# EAGLE board darwin-weather-module (EAGLE 9.6.1), part 1 of 2
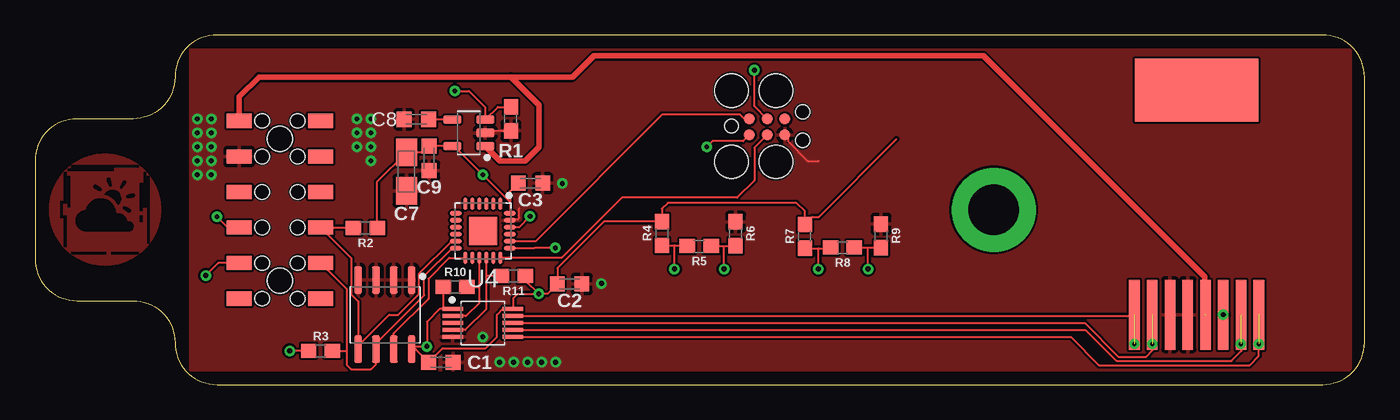
[diagram p1: board, top side]
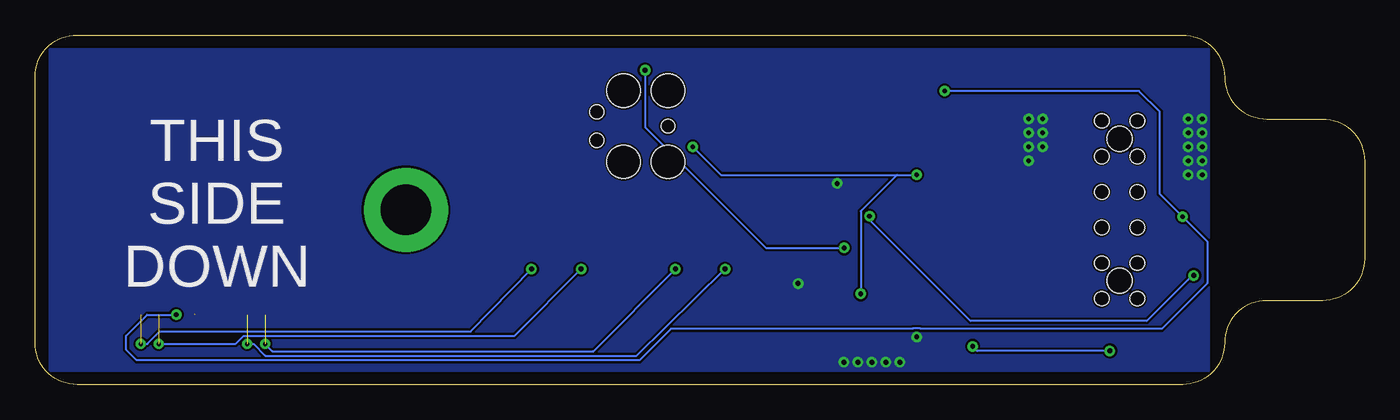
[diagram p2: board, bottom side, seen from below]

Size 95 x 25 mm. Coordinates in mm from the lower left corner, seen from the top.
Outline: 92,0 arc90 95,3 95,22 arc90 92,25 13,25 arc90 10,22 arc-90 7,19 3,19 arc90 0,16 0,9 arc90 3,6 7,6 arc-90 10,3 arc90 13,0 92,0
Copper layers (1*16): Top 0.035mm / dielectric 1.5mm / Bottom 0.035mm
Design rules "default *": minimum track width 6mil, minimum drill 0.35mm, track to track 6mil, track to pad 6mil, pad to pad 6mil, via to via 6mil, smd to smd 6mil, copper to edge 6mil, drill to drill 6mil, minimum pad ring 10mil, minimum via ring 8mil, stop-mask expansion 4mil, vias tented up to drill 40mil, thermal gap 10mil

## Footprints (pad centres in the part's own frame; a part is rotated, then mirrored left to right if it is on the bottom)
C0603K = smd 1.05 x 1.08: 1 -0.875,0; 2 0.875,0
A/3216-18R = smd 1.95 x 1.5: + 1.375,0; - -1.375,0
M20-7810645 = smd 1.02 x 1.78: P$1 -6.35,-2.91; P$2 -3.81,-2.91; P$3 -1.27,-2.91; P$4 1.27,-2.91; P$5 3.81,-2.91; P$6 6.35,-2.91; P$7 6.35,2.91; P$8 3.81,2.91; P$9 1.27,2.91; P$10 -1.27,2.91; P$11 -3.81,2.91; P$12 -6.35,2.91 | hole 1.02: -6.35,1.27; -3.81,1.27; -1.27,1.27; 1.27,1.27; 3.81,1.27; 6.35,1.27; 6.35,-1.27; 3.81,-1.27; 1.27,-1.27; -1.27,-1.27; -3.81,-1.27; -6.35,-1.27 | hole 1.8: -5.08,0; 5.08,0
85513-5009 = smd 0.76 x 5: 1 4.445,0; 2 3.175,0; 3 1.905,0; 4 0.635,0; 5 -0.635,0; 6 -1.905,0; 7 -3.175,0; 8 -4.445,0 | smd 8.8 x 4.5: P$1 0,16.05
TC2030-IDC = smd 0.787 x 0.787: GND 3.81,-0.635; NRESET 2.54,-0.635; SWCLK/TCK 2.54,0.508; SWDIO/TMS 1.27,0.508; SWO/TDO 3.81,0.508; VCC 1.27,-0.635 | hole 0.991: 0,0; 5.08,1.016; 5.08,-1.016 | hole 2.375: 0,2.54; 0,-2.54; 3.175,2.54; 3.175,-2.54
0603 = smd 1.1 x 1: 1 -0.85,0; 2 0.85,0
QFN50P400X400X100-25T200 = smd 0.837 x 0.27: 1 -1.937,1.25; 2 -1.937,0.75; 3 -1.937,0.25; 4 -1.937,-0.25; 5 -1.937,-0.75; 6 -1.937,-1.25; 13 1.937,-1.25; 14 1.937,-0.75; 15 1.937,-0.25; 16 1.937,0.25; 17 1.937,0.75; 18 1.937,1.25 | smd 0.27 x 0.837: 7 -1.25,-1.937; 8 -0.75,-1.937; 9 -0.25,-1.937; 10 0.25,-1.937; 11 0.75,-1.937; 12 1.25,-1.937; 19 1.25,1.937; 20 0.75,1.937; 21 0.25,1.937; 22 -0.25,1.937; 23 -0.75,1.937; 24 -1.25,1.937 | smd 2 x 2: 25 0,0
SOIC127P600X175-8 = smd 1.968 x 0.569: 1 -2.473,1.905; 2 -2.473,0.635; 3 -2.473,-0.635; 4 -2.473,-1.905; 5 2.473,-1.905; 6 2.473,-0.635; 7 2.473,0.635; 8 2.473,1.905
SOP50P490X110-10 = smd 1.438 x 0.297: 1 -2.145,1; 2 -2.145,0.5; 3 -2.145,0; 4 -2.145,-0.5; 5 -2.145,-1; 6 2.145,-1; 7 2.145,-0.5; 8 2.145,0; 9 2.145,0.5; 10 2.145,1
SOT95P280X145-5 = smd 1.262 x 0.609: 1 -1.175,0.95; 2 -1.175,0; 3 -1.175,-0.95; 4 1.175,-0.95; 5 1.175,0.95

## Placement (x,y rotation side)
C1  .1uf  [C0603K]  29,1.6 0 top
C2  .1uf  [C0603K]  38.2,7.2 0 top
C3  .1uf  [C0603K]  35.4,14.4 0 top
C7  6.8uf  [A/3216-18R]  26.54,15.23 90 top
C8  [C0603K]  27.25,18.97 180 top
C9  .1uf  [C0603K]  28.17,16.18 270 top
J1  2X6-HEADERS  [M20-7810645]  17.5,12.5 90 top
J2  95501-6889VERT  [85513-5009]  83,5 0 top
J3  TAG-CONNECT  [TC2030-IDC]  49.77,18.48 0 top
R1  100k  [0603]  34,19 90 top
R2  4.7k  [0603]  23.6,11.2 180 top
R3  4.7k  [0603]  20.4,2.4 0 top
R4  330  [0603]  44.8,10.8 90 top
R5  100  [0603]  47.46,9.89 180 top
R6  300  [0603]  50.06,10.79 270 top
R7  330  [0603]  55,10.6 90 top
R8  100  [0603]  57.69,9.79 180 top
R9  300  [0603]  60.45,10.62 270 top
R10  4.7k  [0603]  30.02,6.98 0 top
R11  4.7k  [0603]  34.18,7.76 180 top
U2  ATSAMD09  [QFN50P400X400X100-25T200]  32,11 270 top
U3  M24C02-WMN6TP  [SOIC127P600X175-8]  25,5 270 top
U4  PCA9615  [SOP50P490X110-10]  32,4.4 0 top
U$4  MIC5219-3.3YM5-TR  [SOT95P280X145-5]  31,18 180 top

## Tracks (layer width: path | path; a pad name or v marks a point on that pad's centre or on a via)
3V3  (via drill 0.35)
  Top 0.152: 33.94,13.06 v32,15 29.95,17.05 U$4.5 C9.1 27.73,16.61 C7.+ 24.45,14.52 R2.1 | 33.94,13.06 U2.24 | C3.1 33.94,13.81 33.94,13.06 | v36,6.49 36.62,6.49 C2.1 37.33,8.32 40.65,11.65 R4.2 44.8,12.57 45.23,13 54.4,13 55,12.4 R7.2 55.55,12 56,12 61.55,17.55 | 27.2,2.53 C1.1 29.12,2.6 32.2,2.6 33,3.4 33,5 33.4,5.4 U4.10 34.2,5.46 34.2,6.2 34.49,6.49 v36,6.49 | 27.2,2.53 27,2.73 v28,2.73 28,4.49 28.91,5.4 29.22,5.4 | 27.2,2.53 U3.8 | R3.1 v18.2,2.4 | 29.22,5.4 U4.1 | R11.1 35.03,7.46 v36,6.49 | R10.1 29.17,5.46 29.22,5.4 | J3.VCC 50.59,17.4 48.4,17.4 v48,17
  Bottom 0.152: v36,6.49 36,12.4 33.4,15 v32,15 46,15 v48,17 | v18.2,2.4 27.67,2.4 v28,2.73
ENABLE  (via drill 0.35)
  Top 0.152: R1.2 33.08,19.85 U$4.3 32.17,19.82 31,21 v30,21 | J1.P$10 13.77,11.23 v13,12
  Bottom 0.152: v30,21 16.11,21 14.63,19.51 14.63,13.63 v13,12 11.25,10.25 11.25,7.25 14.5,4 31.74,4 31.75,4.01 32.25,4.01 32.26,4 49.55,4 51.8,1.75 87.75,1.75 88.5,2.5 88.5,3.5 87,5 J2.3
  other vias: 84.91,5
G1  (via drill 0.35)
  Top 0.152: J1.P$11 13.09,8.69 v12.2,7.8 | v35.36,12.04 34.58,11.25 U2.22
  Bottom 0.152: v12.2,7.8 12.31,7.8 15.57,4.55 28.15,4.55 35.36,11.76 v35.36,12.04
GND  (via drill 0.35)
  Top 0.152: U$4.2 32.33,18.15 R1.1 | U2.23 33.99,11.8 34.48,11.8 34.6,11.91 34.6,12.6 | J3.GND 53.81,17.61 53.81,17.4 55.21,16 56,16
  other vias: 23,19 24,19 24,18 23,18 24,17 23,17 24,16 11.6,19 11.6,18 11.6,17 11.6,16 11.6,15 12.6,19 12.6,18 12.6,17 12.6,16 12.6,15 32,3.4 37.2,1.6 33.2,1.6 34.2,1.6 35.2,1.6 36.2,1.6 37.68,14.39 40.47,7.22
  pour Top: 11.1,24 94,24 94,1 11.1,1
  pour Bottom: 11.1,24 94,24 94,1 11.1,1
GND1
  pour Top (rank 3): 6.94,14.7 6.95,14.44 7.2,14.44 7.2,14.7
  pour Top (rank 3): 6.94,14.19 6.95,13.93 7.2,13.93 7.2,14.19
  pour Top (rank 3): 7.11,13.67 7.14,13.64 7.16,13.62 7.18,13.58 7.18,13.55 7.18,13.51 7.18,13.48 7.17,13.46 7.16,13.44 7.14,13.41 7.2,13.41 7.2,13.67 7.11,13.67
  pour Top (rank 3): 6.94,14.45 6.95,14.19 7.2,14.19 7.2,14.44
  pour Top (rank 3): 6.94,13.7 6.97,13.7 6.99,13.71 7.03,13.7 7.05,13.7 7.07,13.69 7.09,13.69 7.11,13.67 7.2,13.67 7.2,13.93 6.95,13.93
  pour Top (rank 3): 2.55,12.64 2.55,12.38 2.81,12.38 2.81,12.64
  pour Top (rank 3): 5.14,10.05 5.14,9.79 5.39,9.79 5.39,10.05
  pour Top (rank 3): 2.55,11.34 2.55,11.08 2.81,11.08 2.81,11.34
  pour Top (rank 3): 3.58,14.96 3.59,14.7 3.84,14.7 3.84,14.96
  pour Top (rank 3): 3.84,14.96 3.84,14.7 4.1,14.7 4.1,14.96
  pour Top (rank 3): 2.55,11.6 2.55,11.34 2.81,11.34 2.81,11.6
  pour Top (rank 3): 2.55,11.86 2.55,11.6 2.81,11.6 2.81,11.86
  pour Top (rank 3): 3.07,14.96 3.07,14.7 3.33,14.7 3.33,14.96
  pour Top (rank 3): 4.1,14.96 4.1,14.7 4.36,14.7 4.36,14.96
  pour Top (rank 3): 3.33,14.96 3.33,14.7 3.58,14.7 3.58,14.96
  pour Top (rank 3): 2.55,12.38 2.55,12.12 2.81,12.12 2.81,12.38
  pour Top (rank 3): 2.55,12.12 2.55,11.86 2.81,11.86 2.81,12.12
  pour Top (rank 3): 4.36,14.96 4.36,14.7 4.62,14.7 4.62,14.96
  pour Top (rank 3): 5.65,14.96 5.65,14.7 5.91,14.7 5.91,14.96
  pour Top (rank 3): 5.91,14.96 5.91,14.7 6.17,14.7 6.17,14.96
  pour Top (rank 3): 6.17,14.96 6.17,14.7 6.43,14.7 6.43,14.96
  pour Top (rank 3): 6.69,14.96 6.69,14.7 6.94,14.7 6.94,14.96
  pour Top (rank 3): 6.43,14.96 6.43,14.7 6.69,14.7 6.69,14.96
  pour Top (rank 3): 5.4,14.78 5.41,14.77 5.42,14.74 5.43,14.73 5.44,14.7 5.65,14.7 5.65,14.96 5.39,14.96 5.39,14.78
  pour Top (rank 3): 5.1,14.7 5.12,14.74 5.14,14.76 5.14,14.96 4.88,14.96 4.88,14.7
  pour Top (rank 3): 6.94,14.96 6.95,14.7 7.2,14.7 7.2,14.96
  pour Top (rank 3): 4.62,14.96 4.62,14.7 4.88,14.7 4.88,14.96
  pour Top (rank 3): 5.14,14.76 5.16,14.79 5.19,14.81 5.23,14.82 5.26,14.83 5.3,14.83 5.32,14.82 5.34,14.82 5.36,14.8 5.38,14.8 5.39,14.78 5.39,14.96 5.14,14.96
  pour Top (rank 3): 7.46,11.34 7.46,11.08 7.72,11.08 7.72,11.34
  pour Top (rank 3): 3.07,10.05 3.07,9.79 3.33,9.79 3.33,10.05
  pour Top (rank 3): 7.14,13.41 7.12,13.39 7.11,13.38 7.08,13.36 7.06,13.36 7.03,13.35 6.95,13.34 6.94,13.15 7.2,13.15 7.2,13.41 7.14,13.41
  pour Top (rank 3): 2.55,10.05 2.55,9.79 2.81,9.79 2.81,10.05
  pour Top (rank 3): 3.33,10.05 3.33,9.79 3.58,9.79 3.58,10.05
  pour Top (rank 3): 4.62,10.57 4.62,10.31 4.88,10.31 4.88,10.57
  pour Top (rank 3): 4.36,10.57 4.36,10.31 4.62,10.31 4.62,10.57
  pour Top (rank 3): 2.81,14.96 2.81,14.7 3.07,14.7 3.07,14.96
  pour Top (rank 3): 2.55,10.31 2.55,10.05 2.81,10.05 2.81,10.31
  pour Top (rank 3): 2.55,10.83 2.55,10.57 2.81,10.57 2.81,10.83
  pour Top (rank 3): 2.55,10.57 2.55,10.31 2.81,10.31 2.81,10.57
  pour Top (rank 3): 3.84,10.05 3.84,9.79 4.1,9.79 4.1,10.05
  pour Top (rank 3): 4.88,10.05 4.88,9.79 5.13,9.79 5.13,10.05
  pour Top (rank 3): 3.84,10.57 3.84,10.31 4.1,10.31 4.1,10.57
  pour Top (rank 3): 4.1,10.57 4.1,10.31 4.36,10.31 4.36,10.57
  pour Top (rank 3): 4.62,10.05 4.62,9.79 4.88,9.79 4.88,10.05
  pour Top (rank 3): 3.58,10.57 3.59,10.31 3.84,10.31 3.84,10.57
  pour Top (rank 3): 3.33,10.57 3.33,10.31 3.58,10.31 3.58,10.57
  pour Top (rank 3): 3.58,10.05 3.59,9.79 3.84,9.79 3.84,10.05
  pour Top (rank 3): 4.36,10.05 4.36,9.79 4.62,9.79 4.62,10.05
  pour Top (rank 3): 4.88,10.57 4.88,10.31 5.13,10.31 5.13,10.57
  pour Top (rank 3): 4.1,10.05 4.1,9.79 4.36,9.79 4.36,10.05
  pour Top (rank 3): 2.81,10.05 2.81,9.79 3.07,9.79 3.07,10.05
  pour Top (rank 3): 6.94,12.12 6.95,11.86 7.2,11.86 7.2,12.12
  pour Top (rank 3): 6.94,12.38 6.95,12.12 7.2,12.12 7.2,12.38
  pour Top (rank 3): 6.97,11.59 6.99,11.57 7.02,11.53 7.05,11.48 7.07,11.43 7.08,11.4 7.08,11.38 7.09,11.34 7.2,11.34 7.2,11.6 6.96,11.6
  pour Top (rank 3): 6.94,11.62 6.96,11.6 7.2,11.6 7.2,11.86 6.95,11.86
  pour Top (rank 3): 5.14,10.57 5.14,10.31 5.39,10.31 5.39,10.57
  pour Top (rank 3): 6.94,13.15 6.95,12.89 7.2,12.89 7.2,13.15
  pour Top (rank 3): 7.09,11.33 7.09,11.3 7.08,11.25 7.07,11.19 7.05,11.14 7.04,11.12 7.02,11.08 7.2,11.08 7.2,11.34 7.09,11.34
  pour Top (rank 3): 6.94,12.89 6.95,12.64 7.2,12.64 7.2,12.89
  pour Top (rank 3): 6.94,12.64 6.95,12.38 7.2,12.38 7.2,12.64
  pour Top (rank 3): 3.07,10.57 3.07,10.31 3.33,10.31 3.33,10.57
  pour Top (rank 3): 2.55,11.08 2.55,10.83 2.81,10.83 2.81,11.08
  pour Top (rank 3): 6.17,10.57 6.17,10.31 6.43,10.31 6.43,10.57
  pour Top (rank 3): 5.65,10.57 5.65,10.31 5.91,10.31 5.91,10.57
  pour Top (rank 3): 5.91,10.57 5.91,10.31 6.17,10.31 6.17,10.57
  pour Top (rank 3): 7.01,11.07 6.97,11.03 6.94,11.01 6.94,10.83 7.2,10.83 7.2,11.08 7.02,11.08
  pour Top (rank 3): 5.39,10.57 5.39,10.31 5.65,10.31 5.65,10.57
  pour Top (rank 3): 6.94,10.83 6.95,10.57 7.2,10.57 7.2,10.83
  pour Top (rank 3): 6.43,10.57 6.43,10.31 6.69,10.31 6.69,10.57
  pour Top (rank 3): 6.94,10.57 6.95,10.31 7.2,10.31 7.2,10.57
  pour Top (rank 3): 6.69,10.57 6.69,10.31 6.94,10.31 6.94,10.57
  pour Top (rank 3): 4.62,10.31 4.62,10.05 4.88,10.05 4.88,10.31
  pour Top (rank 3): 6.94,10.05 6.95,9.79 7.2,9.79 7.2,10.05
  pour Top (rank 3): 7.2,12.89 7.2,12.64 7.46,12.64 7.46,12.89
  pour Top (rank 3): 7.2,12.64 7.2,12.38 7.46,12.38 7.46,12.64
  pour Top (rank 3): 7.2,12.12 7.2,11.86 7.46,11.86 7.46,12.12
  pour Top (rank 3): 7.2,12.38 7.2,12.12 7.46,12.12 7.46,12.38
  pour Top (rank 3): 7.2,13.67 7.2,13.41 7.46,13.41 7.46,13.67
  pour Top (rank 3): 7.2,14.19 7.2,13.93 7.46,13.93 7.46,14.19
  pour Top (rank 3): 7.2,14.45 7.2,14.19 7.46,14.19 7.46,14.44
  pour Top (rank 3): 7.2,13.93 7.2,13.67 7.46,13.67 7.46,13.93
  pour Top (rank 3): 7.2,11.86 7.2,11.6 7.46,11.6 7.46,11.86
  pour Top (rank 3): 7.2,13.41 7.2,13.15 7.46,13.15 7.46,13.41
  pour Top (rank 3): 7.2,13.15 7.2,12.89 7.46,12.89 7.46,13.15
  pour Top (rank 3): 3.33,15.22 3.33,14.96 3.58,14.96 3.58,15.22
  pour Top (rank 3): 7.46,10.83 7.46,10.57 7.72,10.57 7.72,10.83
  pour Top (rank 3): 7.46,10.57 7.46,10.31 7.72,10.31 7.72,10.57
  pour Top (rank 3): 2.55,15.22 2.55,14.96 2.81,14.96 2.81,15.22
  pour Top (rank 3): 3.07,15.22 3.07,14.96 3.33,14.96 3.33,15.22
  pour Top (rank 3): 7.2,11.6 7.2,11.34 7.46,11.34 7.46,11.6
  pour Top (rank 3): 7.46,10.31 7.46,10.05 7.72,10.05 7.72,10.31
  pour Top (rank 3): 7.2,11.08 7.2,10.83 7.46,10.83 7.46,11.08
  pour Top (rank 3): 7.2,11.34 7.2,11.08 7.46,11.08 7.46,11.34
  pour Top (rank 3): 7.2,10.05 7.2,9.79 7.46,9.79 7.46,10.05
  pour Top (rank 3): 7.46,10.05 7.46,9.79 7.72,9.79 7.72,10.05
  pour Top (rank 3): 2.81,15.22 2.81,14.96 3.07,14.96 3.07,15.22
  pour Top (rank 3): 7.2,14.7 7.2,14.44 7.46,14.44 7.46,14.7
  pour Top (rank 3): 4.88,15.22 4.88,14.96 5.13,14.96 5.13,15.22
  pour Top (rank 3): 7.2,15.22 7.2,14.96 7.46,14.96 7.46,15.22
  pour Top (rank 3): 5.39,15.22 5.39,14.96 5.65,14.96 5.65,15.22
  pour Top (rank 3): 5.14,15.22 5.14,14.96 5.39,14.96 5.39,15.22
  pour Top (rank 3): 7.2,14.96 7.2,14.7 7.46,14.7 7.46,14.96
  pour Top (rank 3): 6.17,15.22 6.17,14.96 6.43,14.96 6.43,15.22
  pour Top (rank 3): 5.65,15.22 5.65,14.96 5.91,14.96 5.91,15.22
  pour Top (rank 3): 6.69,15.22 6.69,14.96 6.94,14.96 6.94,15.22
  pour Top (rank 3): 6.43,15.22 6.43,14.96 6.69,14.96 6.69,15.22
  pour Top (rank 3): 6.94,15.22 6.95,14.96 7.2,14.96 7.2,15.22
  pour Top (rank 3): 5.65,10.05 5.65,9.79 5.91,9.79 5.91,10.05
  pour Top (rank 3): 5.91,10.05 5.91,9.79 6.17,9.79 6.17,10.05
  pour Top (rank 3): 6.69,10.05 6.69,9.79 6.94,9.79 6.94,10.05
  pour Top (rank 3): 6.17,10.05 6.17,9.79 6.43,9.79 6.43,10.05
  pour Top (rank 3): 4.62,15.22 4.62,14.96 4.88,14.96 4.88,15.22
  pour Top (rank 3): 5.39,10.05 5.39,9.79 5.65,9.79 5.65,10.05
  pour Top (rank 3): 6.43,10.05 6.43,9.79 6.69,9.79 6.69,10.05
  pour Top (rank 3): 3.58,15.22 3.59,14.96 3.84,14.96 3.84,15.22
  pour Top (rank 3): 4.1,15.22 4.1,14.96 4.36,14.96 4.36,15.22
  pour Top (rank 3): 2.81,14.7 2.81,14.44 3.07,14.44 3.07,14.7
  pour Top (rank 3): 3.84,15.22 3.84,14.96 4.1,14.96 4.1,15.22
  pour Top (rank 3): 4.36,15.22 4.36,14.96 4.62,14.96 4.62,15.22
  pour Top (rank 3): 2.81,10.83 2.81,10.57 3.07,10.57 3.07,10.83
  pour Top (rank 3): 2.55,13.15 2.55,12.89 2.81,12.89 2.81,13.15
  pour Top (rank 3): 2.55,12.89 2.55,12.64 2.81,12.64 2.81,12.89
  pour Top (rank 3): 3.07,11.19 3.04,11.23 3.01,11.27 2.99,11.3 2.96,11.34 2.81,11.34 2.81,11.09 3.07,11.08
  pour Top (rank 3): 2.81,11.08 2.81,10.83 3.07,10.83 3.07,11.08
  pour Top (rank 3): 2.55,14.19 2.55,13.93 2.81,13.93 2.81,14.19
  pour Top (rank 3): 2.95,11.37 2.92,11.44 2.91,11.47 2.89,11.55 2.88,11.6 2.81,11.6 2.81,11.34 2.96,11.34
  pour Top (rank 3): 2.55,13.93 2.55,13.67 2.81,13.67 2.81,13.93
  pour Top (rank 3): 2.55,13.67 2.55,13.41 2.81,13.41 2.81,13.67
  pour Top (rank 3): 2.55,13.41 2.55,13.15 2.81,13.15 2.81,13.41
  pour Top (rank 3): 7.46,11.08 7.46,10.83 7.72,10.83 7.72,11.08
  pour Top (rank 3): 2.89,11.86 2.9,11.93 2.93,12 2.96,12.07 2.99,12.12 2.81,12.12 2.81,11.86 2.89,11.86
  pour Top (rank 3): 2.81,13.93 2.81,13.67 3.07,13.67 3.07,13.93
  pour Top (rank 3): 2.87,11.63 2.87,11.71 2.87,11.75 2.87,11.79 2.89,11.86 2.81,11.86 2.81,11.6 2.88,11.6
  pour Top (rank 3): 2.81,13.67 2.81,13.41 3.07,13.41 3.07,13.67
  pour Top (rank 3): 2.81,14.19 2.81,13.93 3.07,13.93 3.07,14.19
  pour Top (rank 3): 2.81,14.45 2.81,14.19 3.07,14.19 3.07,14.44
  pour Top (rank 3): 2.81,13.41 2.81,13.15 3.07,13.15 3.07,13.41
  pour Top (rank 3): 2.55,14.45 2.55,14.19 2.81,14.19 2.81,14.44
  pour Top (rank 3): 3,12.13 3.04,12.19 3.07,12.23 3.07,12.38 2.81,12.38 2.81,12.12 2.99,12.12
  pour Top (rank 3): 2.81,12.89 2.81,12.64 3.07,12.64 3.07,12.89
  pour Top (rank 3): 2.81,13.15 2.81,12.89 3.07,12.89 3.07,13.15
  pour Top (rank 3): 2.81,12.64 2.81,12.38 3.07,12.38 3.07,12.64
  pour Top (rank 3): 6.94,10.31 6.95,10.05 7.2,10.05 7.2,10.31
  pour Top (rank 3): 6.17,10.31 6.17,10.05 6.43,10.05 6.43,10.31
  pour Top (rank 3): 5.91,10.31 5.91,10.05 6.17,10.05 6.17,10.31
  pour Top (rank 3): 6.43,10.31 6.43,10.05 6.69,10.05 6.69,10.31
  pour Top (rank 3): 5.65,10.31 5.65,10.05 5.91,10.05 5.91,10.31
  pour Top (rank 3): 5.39,10.31 5.39,10.05 5.65,10.05 5.65,10.31
  pour Top (rank 3): 7.2,10.31 7.2,10.05 7.46,10.05 7.46,10.31
  pour Top (rank 3): 7.2,10.83 7.2,10.57 7.46,10.57 7.46,10.83
  pour Top (rank 3): 7.2,10.57 7.2,10.31 7.46,10.31 7.46,10.57
  pour Top (rank 3): 2.55,14.7 2.55,14.44 2.81,14.44 2.81,14.7
  pour Top (rank 3): 6.69,10.31 6.69,10.05 6.94,10.05 6.94,10.31
  pour Top (rank 3): 2.55,14.96 2.55,14.7 2.81,14.7 2.81,14.96
  pour Top (rank 3): 5.14,10.31 5.14,10.05 5.39,10.05 5.39,10.31
  pour Top (rank 3): 3.58,10.31 3.59,10.05 3.84,10.05 3.84,10.31
  pour Top (rank 3): 3.33,10.31 3.33,10.05 3.58,10.05 3.58,10.31
  pour Top (rank 3): 3.07,10.31 3.07,10.05 3.33,10.05 3.33,10.31
  pour Top (rank 3): 4.88,10.31 4.88,10.05 5.13,10.05 5.13,10.31
  pour Top (rank 3): 2.81,10.31 2.81,10.05 3.07,10.05 3.07,10.31
  pour Top (rank 3): 2.81,10.57 2.81,10.31 3.07,10.31 3.07,10.57
  pour Top (rank 3): 4.36,10.31 4.36,10.05 4.62,10.05 4.62,10.31
  pour Top (rank 3): 5.91,15.22 5.91,14.96 6.17,14.96 6.17,15.22
  pour Top (rank 3): 4.1,10.31 4.1,10.05 4.36,10.05 4.36,10.31
  pour Top (rank 3): 3.84,10.31 3.84,10.05 4.1,10.05 4.1,10.31
  pour Top (rank 3): 5.45,14.68 5.48,14.45 5.65,14.45 5.65,14.7 5.44,14.7
  pour Top (rank 3): 6.17,10.91 6.17,10.83 6.43,10.83 6.43,10.91
  pour Top (rank 3): 4.62,10.91 4.62,10.83 4.62,10.83 4.88,10.83 4.88,10.83 4.88,10.91
  pour Top (rank 3): 5.91,10.91 5.91,10.83 6.17,10.83 6.17,10.83 6.17,10.91
  pour Top (rank 3): 5.39,10.91 5.39,10.83 5.65,10.83 5.65,10.91 5.65,10.91
  pour Top (rank 3): 5.14,10.91 5.14,10.83 5.39,10.83 5.39,10.91
  pour Top (rank 3): 4.88,10.91 4.88,10.83 5.14,10.83 5.14,10.91 5.13,10.91
  pour Top (rank 3): 5.65,10.91 5.65,10.83 5.91,10.83 5.91,10.91
  pour Top (rank 3): 4.1,13.67 4.1,13.41 4.36,13.41 4.36,13.67
  pour Top (rank 3): 5.91,12.28 5.97,12.28 6.04,12.27 6.1,12.26 6.17,12.23 6.17,12.38 5.91,12.38
  pour Top (rank 3): 6.43,10.83 6.68,10.83 6.69,10.91 6.43,10.91
  pour Top (rank 3): 5.91,12.64 5.91,12.38 6.17,12.38 6.17,12.64
  pour Top (rank 3): 6.05,12.89 6.03,12.87 5.99,12.83 5.96,12.79 5.94,12.78 5.91,12.83 5.91,12.64 5.91,12.64 6.17,12.64 6.17,12.89 6.05,12.89
  pour Top (rank 3): 6.16,13.11 6.14,13.04 6.11,12.99 6.09,12.95 6.05,12.89 6.17,12.89 6.17,13.14
  pour Top (rank 3): 5.38,13.11 5.39,13.1 5.39,13.15 5.33,13.15
  pour Top (rank 3): 5.14,13.41 5.14,13.51 5.08,13.53 5,13.55 4.92,13.57 4.94,13.61 4.98,13.67 4.88,13.67 4.88,13.41
  pour Top (rank 3): 5.87,12.89 5.65,12.89 5.65,12.81 5.69,12.75 5.71,12.7 5.74,12.64 5.91,12.64 5.91,12.83 5.9,12.85
  pour Top (rank 3): 4.62,13.67 4.62,13.41 4.88,13.41 4.88,13.67
  pour Top (rank 3): 5.76,12.6 5.77,12.55 5.79,12.5 5.81,12.45 5.82,12.38 5.91,12.38 5.91,12.64 5.74,12.64
  pour Top (rank 3): 4.36,13.67 4.36,13.41 4.62,13.41 4.62,13.67
  pour Top (rank 3): 3.84,10.91 3.84,10.83 3.84,10.83 4.1,10.83 4.1,10.91
  pour Top (rank 3): 4.36,10.91 4.36,10.83 4.36,10.83 4.62,10.83 4.62,10.91 4.62,10.91
  pour Top (rank 3): 4.1,10.91 4.1,10.83 4.1,10.83 4.36,10.83 4.36,10.91
  pour Top (rank 3): 3.66,10.91 3.58,10.92 3.58,10.83 3.84,10.83 3.84,10.91
  pour Top (rank 3): 4.16,13.22 4.2,13.24 4.24,13.26 4.33,13.29 4.36,13.3 4.36,13.41 4.1,13.41 4.1,13.18
  pour Top (rank 3): 7.56,15.6 7.46,15.67 7.46,15.48 7.69,15.48
  pour Top (rank 3): 7.84,9.67 7.95,9.79 7.72,9.79 7.72,9.56
  pour Top (rank 3): 6.21,14.45 6.17,14.45 6.17,14.37
  pour Top (rank 3): 6.55,14.43 6.55,14.4 6.54,14.39 6.53,14.36 6.43,14.23 6.43,14.19 6.69,14.19 6.69,14.45 6.56,14.45
  pour Top (rank 3): 6.43,14.19 6.43,13.93 6.69,13.93 6.69,14.19
  pour Top (rank 3): 2.29,12.64 2.29,12.38 2.55,12.38 2.55,12.64
  pour Top (rank 3): 6.08,14.19 6.17,14.37 6.17,14.45 5.91,14.45 5.91,14.19
  pour Top (rank 3): 2.55,15.67 2.46,15.6 2.32,15.48 2.55,15.48
  pour Top (rank 3): 5.65,14.45 5.65,14.19 5.91,14.19 5.91,14.44
  pour Top (rank 3): 3.61,12.55 3.64,12.64 3.64,12.64 3.58,12.64 3.58,12.5 3.6,12.51
  pour Top (rank 3): 5.51,14.26 5.51,14.24 5.51,14.22 5.5,14.21 5.49,14.19 5.65,14.19 5.65,14.45 5.49,14.45
  pour Top (rank 3): 7.95,15.22 7.84,15.34 7.72,15.45 7.72,15.22
  pour Top (rank 3): 5.32,13.43 5.24,13.47 5.16,13.5 5.14,13.51 5.14,13.41 5.35,13.41
  pour Top (rank 3): 6.43,12.77 6.69,12.65 6.69,12.89 6.43,12.89
  pour Top (rank 3): 6.57,11.84 6.6,11.77 6.61,11.71 6.68,11.71 6.69,11.86 6.56,11.86
  pour Top (rank 3): 4.36,13.94 4.36,13.93 4.38,13.93
  pour Top (rank 3): 5.14,14.51 5.14,14.45 5.16,14.45
  pour Top (rank 3): 6.43,12.06 6.47,12.01 6.51,11.95 6.54,11.9 6.56,11.86 6.69,11.86 6.69,12.12 6.43,12.12
  pour Top (rank 3): 6.87,13.67 6.69,13.67 6.69,13.61
  pour Top (rank 3): 6.43,13.93 6.43,13.67 6.69,13.67 6.69,13.93
  pour Top (rank 3): 6.43,13.41 6.48,13.41 6.47,13.45 6.47,13.46 6.48,13.48 6.49,13.5 6.5,13.52 6.51,13.54 6.52,13.55 6.54,13.56 6.56,13.57 6.69,13.61 6.69,13.67 6.43,13.67
  pour Top (rank 3): 6.43,13.15 6.43,12.89 6.69,12.89 6.69,13.15
  pour Top (rank 3): 6.61,13.31 6.59,13.31 6.56,13.31 6.54,13.33 6.52,13.34 6.51,13.35 6.49,13.37 6.48,13.39 6.48,13.41 6.43,13.41 6.43,13.15 6.68,13.15 6.69,13.31
  pour Top (rank 3): 6.43,14.23 6.39,14.19 6.43,14.19
  pour Top (rank 3): 6.68,12.27 6.65,12.27 6.62,12.29 6.51,12.38 6.43,12.38 6.43,12.12 6.69,12.12 6.69,12.26
  pour Top (rank 3): 6.38,12.1 6.43,12.06 6.43,12.12 6.36,12.12
  pour Top (rank 3): 4.8,13.92 4.79,13.89 4.78,13.87 4.75,13.84 4.73,13.83 4.72,13.82 4.7,13.82 4.68,13.81 4.65,13.81 4.62,13.82 4.62,13.67 4.88,13.67 4.88,13.93 4.8,13.93
  pour Top (rank 3): 6.17,12.64 6.24,12.64 6.24,12.66 6.24,12.68 6.25,12.71 6.26,12.73 6.28,12.75 6.3,12.76 6.31,12.77 6.34,12.78 6.37,12.78 6.4,12.78 6.43,12.77 6.43,12.89 6.17,12.89
  pour Top (rank 3): 5.6,12.89 5.65,12.81 5.65,12.89 5.59,12.89
  pour Top (rank 3): 4.1,13.93 4.1,13.67 4.36,13.67 4.36,13.93
  pour Top (rank 3): 6.17,12.23 6.22,12.21 6.28,12.18 6.33,12.14 6.36,12.12 6.43,12.12 6.43,12.38 6.17,12.38
  pour Top (rank 3): 4.98,13.67 5.01,13.71 5.04,13.75 5.09,13.8 5.14,13.83 5.14,13.93 4.88,13.93 4.88,13.67
  pour Top (rank 3): 5.14,13.84 5.18,13.87 5.23,13.89 5.27,13.91 5.32,13.93 5.14,13.93 5.14,13.83
  pour Top (rank 3): 6.28,12.55 6.27,12.56 6.25,12.59 6.24,12.61 6.24,12.64 6.17,12.64 6.17,12.38 6.43,12.38 6.43,12.44
  pour Top (rank 3): 6.43,12.38 6.51,12.38 6.43,12.44
  pour Top (rank 3): 5.39,13.15 5.39,13.1 5.46,13.04 5.5,13.01 5.53,12.97 5.59,12.89 5.65,12.89 5.65,13.15
  pour Top (rank 3): 3.07,10.83 3.07,10.57 3.33,10.57 3.33,10.83
  pour Top (rank 3): 3.84,13.93 3.84,13.67 4.1,13.67 4.1,13.93
  pour Top (rank 3): 3.65,12.64 3.67,12.68 3.71,12.77 3.73,12.81 3.79,12.89 3.79,12.89 3.58,12.89 3.58,12.64 3.64,12.64
  pour Top (rank 3): 4.08,13.17 4.1,13.18 4.1,13.41 3.84,13.41 3.84,13.15 4.06,13.15
  pour Top (rank 3): 4.41,13.32 4.51,13.34 4.55,13.34 4.62,13.35 4.62,13.41 4.36,13.41 4.36,13.3
  pour Top (rank 3): 3.91,13.02 3.97,13.09 4.01,13.11 4.06,13.15 3.84,13.15 3.84,12.96
  pour Top (rank 3): 5.65,12.89 5.87,12.89 5.86,12.93 5.81,13 5.76,13.06 5.71,13.13 5.68,13.15 5.65,13.15
  pour Top (rank 3): 5.59,13.24 5.52,13.3 5.46,13.35 5.39,13.39 5.39,13.15 5.65,13.15 5.65,13.18
  pour Top (rank 3): 5.68,13.15 5.65,13.18 5.65,13.15
  pour Top (rank 3): 4.91,13.33 4.96,13.32 5.01,13.31 5.06,13.29 5.13,13.26 5.14,13.41 4.88,13.41 4.88,13.34
  pour Top (rank 3): 5.16,13.25 5.21,13.23 5.25,13.2 5.33,13.15 5.39,13.15 5.39,13.39 5.35,13.41 5.14,13.41 5.14,13.26
  pour Top (rank 3): 4.65,13.35 4.69,13.35 4.75,13.35 4.8,13.35 4.88,13.34 4.88,13.41 4.62,13.41 4.62,13.35
  pour Top (rank 3): 3.84,13.67 3.84,13.41 4.1,13.41 4.1,13.67
  pour Top (rank 3): 6.08,13.65 6.11,13.61 6.13,13.56 6.15,13.51 6.17,13.45 6.17,13.67 6.07,13.67
  pour Top (rank 3): 3.84,14.19 3.84,13.93 4.1,13.93 4.1,14.19
  pour Top (rank 3): 4.36,13.93 4.36,13.94 4.23,14 4.2,14.02 4.19,14.03 4.16,14.06 4.16,14.08 4.15,14.1 4.14,14.13 4.14,14.14 4.14,14.17 4.14,14.19 4.1,14.19 4.1,13.93
  pour Top (rank 3): 5.75,13.92 5.82,13.89 5.87,13.86 5.91,13.84 5.91,13.93 5.73,13.93
  pour Top (rank 3): 5.83,12.34 5.84,12.28 5.91,12.28 5.91,12.38 5.82,12.38
  pour Top (rank 3): 5.93,13.82 5.97,13.79 6,13.75 6.04,13.72 6.07,13.67 6.17,13.67 6.17,13.93 5.91,13.93 5.91,13.84
  pour Top (rank 3): 3.58,13.41 3.59,13.15 3.84,13.15 3.84,13.41
  pour Top (rank 3): 3.81,12.92 3.84,12.96 3.84,13.15 3.58,13.15 3.58,12.89 3.79,12.89
  pour Top (rank 3): 3.58,13.93 3.59,13.67 3.84,13.67 3.84,13.93
  pour Top (rank 3): 3.58,13.67 3.59,13.41 3.84,13.41 3.84,13.67
  pour Top (rank 3): 3.58,14.19 3.59,13.93 3.84,13.93 3.84,14.19
  pour Top (rank 3): 5.32,13.93 5.39,13.95 5.39,14.12 5.36,14.12 5.34,14.13 5.32,14.14 5.3,14.15 5.28,14.16 5.26,14.19 5.14,14.19 5.14,13.93
  pour Top (rank 3): 6.25,14 6.23,13.99 6.21,13.97 6.19,13.97 6.17,13.96 6.17,13.93 6.43,13.93 6.43,14.19 6.39,14.19
  pour Top (rank 3): 6.17,13.93 6.17,13.67 6.43,13.67 6.43,13.93
  pour Top (rank 3): 6.18,13.39 6.19,13.34 6.19,13.29 6.18,13.21 6.17,13.15 6.43,13.15 6.43,13.41 6.18,13.41 6.18,13.41
  pour Top (rank 3): 6.17,13.93 6.17,13.96 6.13,13.96 6.11,13.97 6.1,13.98 6.08,13.99 6.06,14.01 6.06,14.02 6.05,14.04 6.04,14.05 6.04,14.07 6.04,14.08 6.04,14.11 6.05,14.12 6.08,14.19 5.91,14.19 5.91,13.93
  pour Top (rank 3): 6.17,13.45 6.18,13.41 6.43,13.41 6.43,13.67 6.17,13.67
  pour Top (rank 3): 4.62,14.19 4.57,14.19 4.62,14.15
  pour Top (rank 3): 4.88,14.19 4.88,13.93 5.13,13.93 5.13,14.19
  pour Top (rank 3): 4.75,14.05 4.76,14.04 4.78,14.02 4.79,13.99 4.8,13.96 4.8,13.95 4.8,13.93 4.88,13.93 4.88,14.19 4.62,14.19 4.62,14.15
  pour Top (rank 3): 5.65,13.95 5.73,13.93 5.91,13.93 5.91,14.19 5.65,14.19 5.65,13.95
  pour Top (rank 3): 6.17,13.14 6.17,12.89 6.43,12.89 6.43,13.15 6.17,13.15
  pour Top (rank 3): 5.49,14.18 5.47,14.15 5.44,14.14 5.42,14.13 5.39,14.12 5.39,13.95 5.45,13.96 5.52,13.96 5.55,13.96 5.6,13.96 5.65,13.95 5.65,14.19 5.49,14.19
  pour Top (rank 3): 4.62,13.67 4.62,13.82 4.38,13.93 4.36,13.93 4.36,13.67
  pour Top (rank 3): 5.65,14.7 5.65,14.44 5.91,14.44 5.91,14.7
  pour Top (rank 3): 7.46,11.6 7.46,11.34 7.72,11.34 7.72,11.6
  pour Top (rank 3): 5.91,14.7 5.91,14.44 6.17,14.44 6.17,14.7
  pour Top (rank 3): 8.33,10.27 8.36,10.31 8.24,10.31 8.24,10.14
  pour Top (rank 3): 6.21,14.45 6.25,14.54 6.27,14.56 6.29,14.58 6.32,14.6 6.35,14.61 6.39,14.62 6.41,14.61 6.43,14.61 6.43,14.7 6.17,14.7 6.17,14.45
  pour Top (rank 3): 6.43,14.61 6.46,14.6 6.49,14.59 6.5,14.57 6.52,14.55 6.54,14.53 6.55,14.5 6.55,14.48 6.56,14.45 6.69,14.45 6.69,14.7 6.43,14.7 6.43,14.61
  pour Top (rank 3): 8.24,11.86 8.24,11.6 8.49,11.6 8.5,11.86
  pour Top (rank 3): 5.14,14.45 5.14,14.51 5.1,14.59 5.09,14.63 5.09,14.65 5.09,14.67 5.1,14.7 4.88,14.7 4.88,14.45
  pour Top (rank 3): 6.8,12.6 6.83,12.58 6.86,12.56 6.87,12.53 6.89,12.5 6.9,12.47 6.9,12.43 6.89,12.41 6.89,12.38 6.94,12.38 6.94,12.64 6.72,12.64
  pour Top (rank 3): 8.24,10.83 8.24,10.57 8.49,10.57 8.5,10.83
  pour Top (rank 3): 6.69,14.7 6.69,14.44 6.94,14.44 6.94,14.7
  pour Top (rank 3): 8.24,13.41 8.24,13.15 8.49,13.15 8.5,13.41
  pour Top (rank 3): 6.69,12.65 6.72,12.64 6.94,12.64 6.94,12.89 6.69,12.89
  pour Top (rank 3): 4.1,9.28 4.1,9.02 4.36,9.02 4.36,9.27
  pour Top (rank 3): 6.69,13.15 6.94,13.15 6.94,13.34 6.69,13.32
  pour Top (rank 3): 3.07,9.28 3.07,9.02 3.33,9.02 3.33,9.27
  pour Top (rank 3): 4.62,14.7 4.62,14.44 4.88,14.44 4.88,14.7
  pour Top (rank 3): 6.69,13.15 6.69,12.89 6.94,12.89 6.94,13.15
  pour Top (rank 3): 5.65,9.28 5.65,9.02 5.91,9.02 5.91,9.27
  pour Top (rank 3): 6.69,13.67 6.87,13.67 6.94,13.7 6.94,13.93 6.69,13.93
  pour Top (rank 3): 6.69,14.19 6.69,13.93 6.94,13.93 6.94,14.19
  pour Top (rank 3): 7.2,9.16 7.25,9.18 7.37,9.28 7.2,9.27
  pour Top (rank 3): 6.69,14.45 6.69,14.19 6.94,14.19 6.94,14.44
  pour Top (rank 3): 6.69,9.28 6.69,9.02 6.94,9.02 6.94,9.27
  pour Top (rank 3): 8.24,14.45 8.24,14.19 8.49,14.19 8.5,14.44
  pour Top (rank 3): 4.36,14.7 4.36,14.44 4.62,14.44 4.62,14.7
  pour Top (rank 3): 1.52,14.45 1.52,14.19 1.77,14.19 1.78,14.44
  pour Top (rank 3): 8.36,14.7 8.33,14.75 8.24,14.88 8.24,14.7
  pour Top (rank 3): 3.11,12.27 3.16,12.32 3.19,12.34 3.24,12.38 3.07,12.38 3.07,12.23
  pour Top (rank 3): 3.25,12.38 3.28,12.4 3.33,12.43 3.33,12.64 3.07,12.64 3.07,12.38 3.24,12.38
  pour Top (rank 3): 3.17,11.1 3.11,11.15 3.07,11.19 3.07,11.08 3.18,11.08
  pour Top (rank 3): 3.33,11 3.27,11.03 3.24,11.05 3.19,11.08 3.07,11.08 3.07,10.83 3.33,10.83
  pour Top (rank 3): 3.07,12.89 3.07,12.64 3.33,12.64 3.33,12.89
  pour Top (rank 3): 1.52,10.83 1.52,10.57 1.77,10.57 1.78,10.83
  pour Top (rank 3): 1.66,10.31 1.68,10.27 1.78,10.14 1.78,10.31
  pour Top (rank 3): 9.01,12.51 9.01,12.55 9.01,12.46
  pour Top (rank 3): 1.68,14.75 1.66,14.7 1.78,14.7 1.78,14.87
  pour Top (rank 3): 3.33,14.7 3.33,14.44 3.58,14.44 3.58,14.7
  pour Top (rank 3): 3.58,14.7 3.59,14.44 3.84,14.44 3.84,14.7
  pour Top (rank 3): 3.07,14.7 3.07,14.44 3.33,14.44 3.33,14.7
  pour Top (rank 3): 4.1,14.7 4.1,14.44 4.36,14.44 4.36,14.7
  pour Top (rank 3): 3.07,13.15 3.07,12.89 3.33,12.89 3.33,13.15
  pour Top (rank 3): 3.84,14.7 3.84,14.44 4.1,14.44 4.1,14.7
  pour Top (rank 3): 3.07,13.67 3.07,13.41 3.33,13.41 3.33,13.67
  pour Top (rank 3): 3.07,13.41 3.07,13.15 3.33,13.15 3.33,13.41
  pour Top (rank 3): 5.26,14.19 5.26,14.2 5.16,14.45 5.14,14.45 5.14,14.19
  pour Top (rank 3): 3.07,14.19 3.07,13.93 3.33,13.93 3.33,14.19
  pour Top (rank 3): 3.07,14.45 3.07,14.19 3.33,14.19 3.33,14.44
  pour Top (rank 3): 3.07,13.93 3.07,13.67 3.33,13.67 3.33,13.93
  pour Top (rank 3): 2.06,9.79 2.17,9.67 2.29,9.56 2.29,9.79
  pour Top (rank 3): 7.46,9.34 7.55,9.41 7.69,9.53 7.46,9.53
  pour Top (rank 3): 2.46,9.41 2.55,9.34 2.55,9.53 2.32,9.53
  pour Top (rank 3): 3.38,12.45 3.41,12.46 3.48,12.49 3.52,12.49 3.58,12.5 3.58,12.63 3.33,12.64 3.33,12.43
  pour Top (rank 3): 2.17,15.34 2.06,15.22 2.29,15.22 2.29,15.45
  pour Top (rank 3): 8.1,9.96 8.17,10.05 7.98,10.05 7.98,9.82
  pour Top (rank 3): 5.65,16 5.65,15.74 5.91,15.74 5.91,16
  pour Top (rank 3): 3.33,12.89 3.33,12.64 3.58,12.64 3.58,12.89
  pour Top (rank 3): 6.69,16 6.69,15.74 6.94,15.74 6.94,16
  pour Top (rank 3): 7.25,15.83 7.2,15.86 7.2,15.86 7.2,15.74 7.37,15.74
  pour Top (rank 3): 8.17,14.96 8.1,15.06 7.98,15.19 7.98,14.96
  pour Top (rank 3): 4.88,14.45 4.88,14.19 5.13,14.19 5.13,14.44
  pour Top (rank 3): 4.14,14.19 4.15,14.22 4.17,14.25 4.19,14.28 4.22,14.3 4.25,14.32 4.28,14.33 4.31,14.33 4.33,14.33 4.36,14.33 4.36,14.44 4.1,14.44 4.1,14.19
  pour Top (rank 3): 3.33,13.15 3.33,12.89 3.58,12.89 3.58,13.15
  pour Top (rank 3): 4.62,14.45 4.62,14.19 4.88,14.19 4.88,14.44
  pour Top (rank 3): 3.84,14.45 3.84,14.19 4.1,14.19 4.1,14.44
  pour Top (rank 3): 3.58,10.92 3.53,10.93 3.45,10.95 3.38,10.98 3.33,11 3.33,10.83 3.58,10.83
  pour Top (rank 3): 4.36,14.33 4.39,14.32 4.42,14.3 4.57,14.19 4.62,14.19 4.62,14.45 4.36,14.45
  pour Top (rank 3): 3.33,13.41 3.33,13.15 3.58,13.15 3.58,13.41
  pour Top (rank 3): 3.33,13.67 3.33,13.41 3.58,13.41 3.58,13.67
  pour Top (rank 3): 3.33,14.19 3.33,13.93 3.58,13.93 3.58,14.19
  pour Top (rank 3): 3.33,13.93 3.33,13.67 3.58,13.67 3.58,13.93
  pour Top (rank 3): 3.33,14.45 3.33,14.19 3.58,14.19 3.58,14.44
  pour Top (rank 3): 4.36,10.83 4.36,10.57 4.62,10.57 4.62,10.83
  pour Top (rank 3): 2.81,15.86 2.77,15.83 2.64,15.74 2.81,15.74
  pour Top (rank 3): 4.1,16 4.1,15.74 4.36,15.74 4.36,16
  pour Top (rank 3): 3.07,16 3.07,15.74 3.33,15.74 3.33,16
  pour Top (rank 3): 6.43,10.83 6.43,10.57 6.69,10.57 6.69,10.83
  pour Top (rank 3): 3.33,10.83 3.33,10.57 3.58,10.57 3.58,10.83
  pour Top (rank 3): 6.69,10.83 6.69,10.57 6.94,10.57 6.94,10.83
  pour Top (rank 3): 6.69,12.12 6.69,11.86 6.94,11.86 6.94,12.12
  pour Top (rank 3): 6.69,11.71 6.71,11.71 6.76,11.71 6.82,11.69 6.86,11.67 6.89,11.66 6.91,11.64 6.94,11.62 6.94,11.86 6.69,11.86
  pour Top (rank 3): 2.77,9.18 2.81,9.16 2.81,9.27 2.81,9.28 2.64,9.28
  pour Top (rank 3): 1.84,10.05 1.92,9.96 2.03,9.82 2.03,10.05
  pour Top (rank 3): 1.91,15.06 1.84,14.96 2.03,14.96 2.03,15.19
  pour Top (rank 3): 6.91,10.98 6.86,10.95 6.81,10.93 6.76,10.92 6.74,10.92 6.71,10.91 6.69,10.91 6.69,10.83 6.94,10.83 6.94,11.01
  pour Top (rank 3): 6.89,12.37 6.87,12.35 6.86,12.33 6.84,12.31 6.81,12.29 6.78,12.27 6.75,12.26 6.72,12.26 6.69,12.26 6.69,12.12 6.94,12.12 6.94,12.38 6.94,12.38 6.89,12.38
  pour Top (rank 3): 4.1,10.83 4.1,10.57 4.36,10.57 4.36,10.83
  pour Top (rank 3): 3.58,10.83 3.59,10.57 3.84,10.57 3.84,10.83
  pour Top (rank 3): 4.62,10.83 4.62,10.57 4.88,10.57 4.88,10.83
  pour Top (rank 3): 3.84,10.83 3.84,10.57 4.1,10.57 4.1,10.83
  pour Top (rank 3): 5.39,10.83 5.39,10.57 5.65,10.57 5.65,10.83
  pour Top (rank 3): 5.65,10.83 5.65,10.57 5.91,10.57 5.91,10.83
  pour Top (rank 3): 5.91,10.83 5.91,10.57 6.17,10.57 6.17,10.83
  pour Top (rank 3): 5.14,10.83 5.14,10.57 5.39,10.57 5.39,10.83
  pour Top (rank 3): 4.88,10.83 4.88,10.57 5.13,10.57 5.13,10.83
  pour Top (rank 3): 6.17,10.83 6.17,10.57 6.43,10.57 6.43,10.83
  pour Top (rank 3): 3.58,14.45 3.59,14.19 3.84,14.19 3.84,14.44
  pour Top (rank 3): 5.39,9.28 5.39,9.02 5.65,9.02 5.65,9.27
  pour Top (rank 3): 5.14,9.28 5.14,9.02 5.39,9.02 5.39,9.27
  pour Top (rank 3): 5.39,9.02 5.39,8.76 5.65,8.76 5.65,9.02
  pour Top (rank 3): 4.36,9.28 4.36,9.02 4.62,9.02 4.62,9.27
  pour Top (rank 3): 4.62,9.28 4.62,9.02 4.88,9.02 4.88,9.27
  pour Top (rank 3): 4.88,9.28 4.88,9.02 5.13,9.02 5.13,9.27
  pour Top (rank 3): 6.17,9.28 6.17,9.02 6.43,9.02 6.43,9.27
  pour Top (rank 3): 6.43,9.28 6.43,9.02 6.69,9.02 6.69,9.27
  pour Top (rank 3): 5.91,9.02 5.91,8.76 6.17,8.76 6.17,9.02
  pour Top (rank 3): 5.91,9.28 5.91,9.02 6.17,9.02 6.17,9.27
  pour Top (rank 3): 5.65,9.02 5.65,8.76 5.91,8.76 5.91,9.02
  pour Top (rank 3): 3.07,9.28 2.81,9.27 2.81,9.16 2.93,9.08 3.04,9.02 3.07,9.02
  pour Top (rank 3): 3.07,9.02 3.07,9 3.1,8.98 3.27,8.9 3.33,8.87 3.33,9.02 3.32,9.02
  pour Top (rank 3): 3.33,8.87 3.45,8.81 3.58,8.76 3.58,9.02 3.33,9.02
  pour Top (rank 3): 3.04,9.02 3.07,9 3.07,9.02
  pour Top (rank 3): 3.33,9.28 3.33,9.02 3.58,9.02 3.58,9.27
  pour Top (rank 3): 6.43,9.02 6.43,8.76 6.57,8.82 6.69,8.87 6.69,9.02
  pour Top (rank 3): 4.1,9.02 4.1,8.76 4.36,8.76 4.36,9.02
  pour Top (rank 3): 6.94,15.74 7.2,15.74 7.2,15.86 7.08,15.93 6.98,16 6.94,16
  pour Top (rank 3): 3.84,9.02 3.84,8.76 4.1,8.76 4.1,9.02
  pour Top (rank 3): 3.84,9.28 3.84,9.02 4.1,9.02 4.1,9.27
  pour Top (rank 3): 3.58,9.28 3.59,9.02 3.84,9.02 3.84,9.27
  pour Top (rank 3): 8.64,10.83 8.7,10.95 8.75,11.08 8.5,11.08 8.5,10.83
  pour Top (rank 3): 8.24,12.64 8.24,12.38 8.49,12.38 8.5,12.64
  pour Top (rank 3): 8.24,12.38 8.24,12.12 8.49,12.12 8.5,12.38
  pour Top (rank 3): 8.24,12.12 8.24,11.86 8.49,11.86 8.5,12.12
  pour Top (rank 3): 8.5,12.12 8.5,11.86 8.75,11.86 8.75,12.12
  pour Top (rank 3): 8.24,12.89 8.24,12.64 8.49,12.64 8.5,12.89
  pour Top (rank 3): 8.24,13.15 8.24,12.89 8.49,12.89 8.5,13.15
  pour Top (rank 3): 8.5,13.67 8.5,13.41 8.75,13.41 8.75,13.67
  pour Top (rank 3): 8.24,13.67 8.24,13.41 8.49,13.41 8.5,13.67
  pour Top (rank 3): 8.5,13.41 8.5,13.15 8.75,13.15 8.75,13.41
  pour Top (rank 3): 8.5,11.86 8.5,11.6 8.75,11.6 8.75,11.86
  pour Top (rank 3): 8.5,13.15 8.5,12.89 8.75,12.89 8.75,13.15
  pour Top (rank 3): 1.84,10.05 2.03,10.05 2.03,10.31 1.78,10.31 1.78,10.14 1.8,10.11
  pour Top (rank 3): 8.5,11.6 8.5,11.34 8.75,11.34 8.75,11.6
  pour Top (rank 3): 8.5,10.54 8.51,10.57 8.5,10.57 8.5,10.57
  pour Top (rank 3): 8.24,10.57 8.24,10.31 8.36,10.31 8.43,10.43 8.49,10.54 8.5,10.57
  pour Top (rank 3): 7.2,9.16 7.2,9.27 6.94,9.28 6.94,9.02 6.98,9.02 7.08,9.08
  pour Top (rank 3): 6.94,9 6.97,9.02 6.94,9.02
  pour Top (rank 3): 8.5,10.57 8.51,10.57 8.53,10.6 8.62,10.77 8.64,10.83 8.5,10.83
  pour Top (rank 3): 8.24,11.6 8.24,11.34 8.49,11.34 8.5,11.6
  pour Top (rank 3): 8.24,11.34 8.24,11.08 8.49,11.08 8.5,11.34
  pour Top (rank 3): 8.24,11.08 8.24,10.83 8.49,10.83 8.5,11.08
  pour Top (rank 3): 6.69,9.02 6.69,8.87 6.74,8.9 6.92,8.98 6.94,9 6.94,9.02 6.94,9.02
  pour Top (rank 3): 1.78,11.86 1.78,11.6 2.03,11.6 2.03,11.86
  pour Top (rank 3): 5.14,16 5.14,15.74 5.39,15.74 5.39,16
  pour Top (rank 3): 4.1,16.25 4.1,16 4.36,16 4.36,16.25
  pour Top (rank 3): 4.36,16 4.36,15.74 4.62,15.74 4.62,16
  pour Top (rank 3): 4.88,16 4.88,15.74 5.13,15.74 5.13,16
  pour Top (rank 3): 4.62,16 4.62,15.74 4.88,15.74 4.88,16
  pour Top (rank 3): 4.36,16.25 4.36,16 4.62,16 4.62,16.25
  pour Top (rank 3): 3.33,16 3.33,16.14 3.27,16.12 3.1,16.03 3.07,16.01 3.07,16 3.07,16
  pour Top (rank 3): 1.78,10.57 1.78,10.31 2.03,10.31 2.03,10.57
  pour Top (rank 3): 3.33,16 3.33,15.74 3.58,15.74 3.58,16
  pour Top (rank 3): 3.58,16 3.59,15.74 3.84,15.74 3.84,16
  pour Top (rank 3): 3.84,16 3.84,15.74 4.1,15.74 4.1,16
  pour Top (rank 3): 3.84,16.25 3.84,16 4.1,16 4.1,16.25
  pour Top (rank 3): 6.17,16 6.17,15.74 6.43,15.74 6.43,16
  pour Top (rank 3): 6.69,16.14 6.57,16.2 6.43,16.25 6.43,16 6.69,16
  pour Top (rank 3): 5.39,16 5.39,15.74 5.65,15.74 5.65,16
  pour Top (rank 3): 6.94,16 6.94,16.01 6.74,16.12 6.69,16.14 6.69,16
  pour Top (rank 3): 6.97,16 6.95,16.01 6.94,16.01 6.94,16
  pour Top (rank 3): 6.43,16 6.43,15.74 6.69,15.74 6.69,16
  pour Top (rank 3): 5.65,16.25 5.65,16 5.91,16 5.91,16.25
  pour Top (rank 3): 5.39,16.25 5.39,16 5.65,16 5.65,16.25
  pour Top (rank 3): 5.91,16 5.91,15.74 6.17,15.74 6.17,16
  pour Top (rank 3): 5.91,16.25 5.91,16 6.17,16 6.17,16.25
  pour Top (rank 3): 3.58,16 3.58,16.25 3.45,16.2 3.33,16.14 3.33,16
  pour Top (rank 3): 1.52,12.12 1.52,11.86 1.77,11.86 1.78,12.12
  pour Top (rank 3): 1.52,11.86 1.52,11.6 1.77,11.6 1.78,11.86
  pour Top (rank 3): 1.52,12.38 1.52,12.12 1.77,12.12 1.78,12.38
  pour Top (rank 3): 1.52,12.64 1.52,12.38 1.77,12.38 1.78,12.64
  pour Top (rank 3): 8.24,13.93 8.24,13.67 8.49,13.67 8.5,13.93
  pour Top (rank 3): 1.78,11.34 1.78,11.08 2.03,11.08 2.03,11.34
  pour Top (rank 3): 1.78,10.83 1.78,10.57 2.03,10.57 2.03,10.83
  pour Top (rank 3): 1.78,11.08 1.78,10.83 2.03,10.83 2.03,11.08
  pour Top (rank 3): 1.52,12.89 1.52,12.64 1.77,12.64 1.78,12.89
  pour Top (rank 3): 1.78,11.6 1.78,11.34 2.03,11.34 2.03,11.6
  pour Top (rank 3): 2.81,15.86 2.81,15.74 3.07,15.74 3.07,16 3.04,16 2.93,15.93
  pour Top (rank 3): 1.78,14.7 1.78,14.44 2.03,14.44 2.03,14.7
  pour Top (rank 3): 1.52,13.15 1.52,12.89 1.77,12.89 1.78,13.15
  pour Top (rank 3): 2.03,14.96 1.84,14.96 1.8,14.9 1.78,14.87 1.78,14.7 2.03,14.7
  pour Top (rank 3): 1.78,14.19 1.78,13.93 2.03,13.93 2.03,14.19
  pour Top (rank 3): 3.07,16.01 3.04,16 3.07,16
  pour Top (rank 3): 1.78,14.45 1.78,14.19 2.03,14.19 2.03,14.44
  pour Top (rank 3): 1.78,13.41 1.78,13.15 2.03,13.15 2.03,13.41
  pour Top (rank 3): 1.52,13.41 1.52,13.15 1.77,13.15 1.78,13.41
  pour Top (rank 3): 1.78,13.67 1.78,13.41 2.03,13.41 2.03,13.67
  pour Top (rank 3): 1.78,13.93 1.78,13.67 2.03,13.67 2.03,13.93
  pour Top (rank 3): 4.36,9.02 4.36,8.76 4.62,8.76 4.62,9.02
  pour Top (rank 3): 8.75,11.6 8.91,11.6 8.93,11.7 8.96,11.86 8.96,11.86 8.75,11.86
  pour Top (rank 3): 8.75,11.09 8.77,11.13 8.83,11.31 8.84,11.34 8.84,11.34 8.75,11.34
  pour Top (rank 3): 8.75,11.34 8.84,11.34 8.89,11.51 8.91,11.6 8.75,11.6
  pour Top (rank 3): 6.17,8.67 6.38,8.74 6.42,8.76 6.17,8.76
  pour Top (rank 3): 6.43,9.02 6.17,9.02 6.17,8.76 6.42,8.76 6.43,8.76
  pour Top (rank 3): 8.5,11.34 8.5,11.08 8.75,11.08 8.75,11.09 8.75,11.34
  pour Top (rank 3): 8.5,12.64 8.5,12.38 8.75,12.38 8.75,12.64
  pour Top (rank 3): 8.5,12.89 8.5,12.64 8.75,12.64 8.75,12.89
  pour Top (rank 3): 8.99,12.12 9.01,12.3 9.01,12.38 8.75,12.38 8.75,12.12
  pour Top (rank 3): 8.75,11.86 8.96,11.86 8.97,11.9 8.99,12.1 8.99,12.12 8.75,12.12
  pour Top (rank 3): 8.5,12.38 8.5,12.12 8.75,12.12 8.75,12.38
  pour Top (rank 3): 4.62,8.52 4.8,8.51 4.88,8.5 4.88,8.76 4.62,8.76
  pour Top (rank 3): 4.88,9.02 4.88,8.76 5.13,8.76 5.13,9.02
  pour Top (rank 3): 4.62,9.02 4.62,8.76 4.88,8.76 4.88,9.02
  pour Top (rank 3): 8.75,12.64 9.01,12.64 9.01,12.71 8.99,12.89 8.75,12.89
  pour Top (rank 3): 4.36,8.76 4.36,8.55 4.4,8.55 4.6,8.52 4.62,8.52 4.62,8.76
  pour Top (rank 3): 4.1,8.76 4.1,8.6 4.2,8.58 4.36,8.55 4.36,8.55 4.36,8.76
  pour Top (rank 3): 5.65,8.76 5.65,8.55 5.81,8.58 5.91,8.6 5.91,8.76
  pour Top (rank 3): 5.14,9.02 5.14,8.76 5.39,8.76 5.39,9.02
  pour Top (rank 3): 5.39,8.76 5.39,8.52 5.42,8.52 5.62,8.55 5.65,8.55 5.65,8.76
  pour Top (rank 3): 5.91,8.76 5.91,8.6 6.01,8.63 6.17,8.67 6.17,8.76
  pour Top (rank 3): 5.14,8.76 5.14,8.5 5.21,8.51 5.39,8.52 5.39,8.76
  pour Top (rank 3): 1.26,11.86 1.05,11.86 1.08,11.7 1.1,11.6 1.26,11.6
  pour Top (rank 3): 1.26,12.12 1.02,12.12 1.02,12.1 1.05,11.9 1.05,11.86 1.26,11.86 1.26,11.86
  pour Top (rank 3): 3.84,8.76 3.84,8.67 4,8.63 4.1,8.6 4.1,8.76
  pour Top (rank 3): 1.26,12.64 1,12.64 1,12.51 1,12.38 1.26,12.38
  pour Top (rank 3): 1.26,12.89 1.02,12.89 1.01,12.71 1,12.64 1.26,12.64
  pour Top (rank 3): 1.26,11.6 1.1,11.6 1.13,11.5 1.17,11.34 1.26,11.34
  pour Top (rank 3): 1.26,12.38 1,12.38 1.01,12.3 1.02,12.12 1.26,12.12
  pour Top (rank 3): 1.17,11.34 1.18,11.31 1.24,11.13 1.26,11.09 1.26,11.34
  pour Top (rank 3): 5.14,8.76 4.88,8.76 4.88,8.5 5.01,8.5 5.14,8.5
  pour Top (rank 3): 8.75,12.64 8.75,12.38 9.01,12.38 9.01,12.46 9.01,12.55 9.01,12.64
  pour Top (rank 3): 1.52,11.08 1.52,11.34 1.26,11.34 1.26,11.09 1.26,11.09
  pour Top (rank 3): 8.5,13.93 8.5,13.67 8.75,13.67 8.75,13.93
  pour Top (rank 3): 1.26,13.15 1.05,13.15 1.05,13.12 1.02,12.89 1.26,12.89
  pour Top (rank 3): 8.75,12.89 8.99,12.89 8.99,12.92 8.97,13.12 8.96,13.15 8.75,13.15
  pour Top (rank 3): 8.75,13.41 8.91,13.41 8.89,13.51 8.84,13.67 8.75,13.67
  pour Top (rank 3): 4.88,16.25 5.14,16.25 5.14,16.51 5.01,16.51 4.88,16.51
  pour Top (rank 3): 8.75,13.15 8.96,13.15 8.93,13.31 8.91,13.41 8.75,13.41
  pour Top (rank 3): 8.84,13.67 8.83,13.7 8.77,13.88 8.75,13.93 8.75,13.67
  pour Top (rank 3): 1.26,13.41 1.1,13.41 1.08,13.31 1.05,13.15 1.26,13.15
  pour Top (rank 3): 1.26,13.67 1.17,13.67 1.13,13.51 1.1,13.41 1.26,13.41
  pour Top (rank 3): 1.26,13.92 1.24,13.88 1.18,13.7 1.17,13.67 1.26,13.67
  pour Top (rank 3): 1.52,13.67 1.52,13.93 1.26,13.93 1.26,13.92 1.26,13.67
  pour Top (rank 3): 3.58,16 3.84,16 3.84,16.25 3.59,16.25 3.58,16.25
  pour Top (rank 3): 4.88,16.25 4.88,16.51 4.8,16.51 4.62,16.49 4.62,16.25
  pour Top (rank 3): 4.62,16.25 4.62,16.49 4.6,16.49 4.4,16.47 4.36,16.46 4.36,16.26
  pour Top (rank 3): 1.52,14.45 1.5,14.44 1.48,14.42 1.39,14.24 1.37,14.19 1.52,14.19
  pour Top (rank 3): 4.88,16.25 4.88,16 5.13,16 5.13,16.25
  pour Top (rank 3): 4.62,16.25 4.62,16 4.88,16 4.88,16.25
  pour Top (rank 3): 4.36,16.25 4.36,16.46 4.2,16.43 4.1,16.41 4.1,16.25
  pour Top (rank 3): 1.78,14.45 1.77,14.7 1.66,14.7 1.58,14.58 1.52,14.48 1.52,14.45
  pour Top (rank 3): 1.52,14.47 1.5,14.45 1.5,14.45 1.52,14.45
  pour Top (rank 3): 3.84,16.34 3.63,16.27 3.59,16.25 3.84,16.25
  pour Top (rank 3): 4.1,16.25 4.1,16.41 4,16.39 3.84,16.34 3.84,16.25
  pour Top (rank 3): 8.24,14.19 8.24,13.93 8.49,13.93 8.5,14.19
  pour Top (rank 3): 5.14,16.25 5.14,16 5.39,16 5.39,16.25
  pour Top (rank 3): 8.36,14.7 8.24,14.7 8.24,14.45 8.49,14.45 8.49,14.48 8.43,14.58
  pour Top (rank 3): 8.51,14.45 8.5,14.48 8.5,14.45
  pour Top (rank 3): 8.5,14.19 8.64,14.19 8.62,14.24 8.53,14.42 8.51,14.45 8.5,14.45 8.5,14.44
  pour Top (rank 3): 8.5,13.93 8.75,13.93 8.7,14.07 8.64,14.19 8.5,14.19
  pour Top (rank 3): 5.39,16.49 5.21,16.51 5.14,16.51 5.14,16.25 5.39,16.25
  pour Top (rank 3): 6.17,16 6.43,16 6.43,16.25 6.42,16.25 6.17,16.25
  pour Top (rank 3): 5.65,16.25 5.65,16.46 5.62,16.47 5.39,16.49 5.39,16.26
  pour Top (rank 3): 5.91,16.25 5.91,16.41 5.81,16.43 5.65,16.46 5.65,16.25
  pour Top (rank 3): 6.17,16.25 6.17,16.34 6.01,16.39 5.91,16.41 5.91,16.41 5.91,16.25
  pour Top (rank 3): 6.42,16.25 6.38,16.27 6.17,16.34 6.17,16.26 6.17,16.25
  pour Top (rank 3): 1.26,13.15 1.26,12.89 1.52,12.89 1.52,13.15
  pour Top (rank 3): 1.52,11.08 1.52,10.83 1.77,10.83 1.78,11.08
  pour Top (rank 3): 1.52,11.34 1.52,11.08 1.77,11.08 1.78,11.34
  pour Top (rank 3): 1.52,11.08 1.26,11.08 1.31,10.95 1.37,10.83 1.52,10.83
  pour Top (rank 3): 1.26,11.6 1.26,11.34 1.52,11.34 1.52,11.6
  pour Top (rank 3): 1.52,11.6 1.52,11.34 1.77,11.34 1.78,11.6
  pour Top (rank 3): 1.66,10.31 1.78,10.31 1.78,10.57 1.52,10.57 1.52,10.54 1.58,10.43
  pour Top (rank 3): 1.52,10.83 1.37,10.83 1.37,10.83 1.4,10.77 1.48,10.6 1.5,10.57 1.52,10.57
  pour Top (rank 3): 1.26,11.86 1.26,11.6 1.52,11.6 1.52,11.86
  pour Top (rank 3): 3.84,9.02 3.58,9.02 3.58,8.76 3.59,8.76 3.84,8.76
  pour Top (rank 3): 1.5,10.57 1.52,10.54 1.52,10.57
  pour Top (rank 3): 1.26,12.38 1.26,12.12 1.52,12.12 1.52,12.38
  pour Top (rank 3): 1.52,13.67 1.52,13.41 1.77,13.41 1.78,13.67
  pour Top (rank 3): 1.26,13.67 1.26,13.41 1.52,13.41 1.52,13.67
  pour Top (rank 3): 1.52,13.93 1.52,13.67 1.77,13.67 1.78,13.93
  pour Top (rank 3): 1.52,14.19 1.52,13.93 1.77,13.93 1.78,14.19
  pour Top (rank 3): 1.26,13.41 1.26,13.15 1.52,13.15 1.52,13.41
  pour Top (rank 3): 1.26,12.89 1.26,12.64 1.52,12.64 1.52,12.89
  pour Top (rank 3): 1.37,14.19 1.31,14.07 1.26,13.93 1.52,13.93 1.52,14.19
  pour Top (rank 3): 1.26,12.64 1.26,12.38 1.52,12.38 1.52,12.64
  pour Top (rank 3): 1.26,12.12 1.26,11.86 1.52,11.86 1.52,12.12
  pour Top (rank 3): 3.59,8.76 3.63,8.74 3.84,8.67 3.84,8.76
  pour Top (rank 3): 5.14,9.53 5.14,9.28 5.39,9.28 5.39,9.53
  pour Top (rank 3): 2.81,9.79 2.81,9.53 3.07,9.53 3.07,9.79
  pour Top (rank 3): 2.55,9.79 2.55,9.53 2.81,9.53 2.81,9.79
  pour Top (rank 3): 2.29,10.31 2.29,10.05 2.55,10.05 2.55,10.31
  pour Top (rank 3): 2.03,12.89 2.03,12.64 2.29,12.64 2.29,12.89
  pour Top (rank 3): 2.29,10.05 2.29,9.79 2.55,9.79 2.55,10.05
  pour Top (rank 3): 2.29,9.79 2.29,9.56 2.32,9.53 2.55,9.53 2.55,9.79
  pour Top (rank 3): 4.1,9.79 4.1,9.53 4.36,9.53 4.36,9.79
  pour Top (rank 3): 4.36,9.79 4.36,9.53 4.62,9.53 4.62,9.79
  pour Top (rank 3): 3.58,9.79 3.59,9.53 3.84,9.53 3.84,9.79
  pour Top (rank 3): 4.62,9.79 4.62,9.53 4.88,9.53 4.88,9.79
  pour Top (rank 3): 3.84,9.79 3.84,9.53 4.1,9.53 4.1,9.79
  pour Top (rank 3): 3.33,9.79 3.33,9.53 3.58,9.53 3.58,9.79
  pour Top (rank 3): 2.29,12.38 2.29,12.12 2.55,12.12 2.55,12.38
  pour Top (rank 3): 2.29,12.12 2.29,11.86 2.55,11.86 2.55,12.12
  pour Top (rank 3): 2.03,12.64 2.03,12.38 2.29,12.38 2.29,12.64
  pour Top (rank 3): 2.29,11.86 2.29,11.6 2.55,11.6 2.55,11.86
  pour Top (rank 3): 2.03,12.38 2.03,12.12 2.29,12.12 2.29,12.38
  pour Top (rank 3): 2.29,11.08 2.29,10.83 2.55,10.83 2.55,11.08
  pour Top (rank 3): 2.29,10.57 2.29,10.31 2.55,10.31 2.55,10.57
  pour Top (rank 3): 2.29,10.83 2.29,10.57 2.55,10.57 2.55,10.83
  pour Top (rank 3): 2.29,11.6 2.29,11.34 2.55,11.34 2.55,11.6
  pour Top (rank 3): 2.29,11.34 2.29,11.08 2.55,11.08 2.55,11.34
  pour Top (rank 3): 3.07,9.79 3.07,9.53 3.33,9.53 3.33,9.79
  pour Top (rank 3): 7.72,10.83 7.72,10.57 7.98,10.57 7.98,10.83
  pour Top (rank 3): 7.72,11.34 7.72,11.08 7.98,11.08 7.98,11.34
  pour Top (rank 3): 7.72,11.08 7.72,10.83 7.98,10.83 7.98,11.08
  pour Top (rank 3): 7.72,10.57 7.72,10.31 7.98,10.31 7.98,10.57
  pour Top (rank 3): 7.72,9.79 7.95,9.79 7.98,9.82 7.98,10.05 7.72,10.05
  pour Top (rank 3): 7.72,10.31 7.72,10.05 7.98,10.05 7.98,10.31
  pour Top (rank 3): 7.72,11.6 7.72,11.34 7.98,11.34 7.98,11.6
  pour Top (rank 3): 7.72,12.38 7.72,12.12 7.98,12.12 7.98,12.38
  pour Top (rank 3): 7.72,12.64 7.72,12.38 7.98,12.38 7.98,12.64
  pour Top (rank 3): 7.72,12.12 7.72,11.86 7.98,11.86 7.98,12.12
  pour Top (rank 3): 7.72,11.86 7.72,11.6 7.98,11.6 7.98,11.86
  pour Top (rank 3): 5.14,9.79 5.14,9.53 5.39,9.53 5.39,9.79
  pour Top (rank 3): 5.91,9.79 5.91,9.53 6.17,9.53 6.17,9.79
  pour Top (rank 3): 6.17,9.79 6.17,9.53 6.43,9.53 6.43,9.79
  pour Top (rank 3): 5.65,9.79 5.65,9.53 5.91,9.53 5.91,9.79
  pour Top (rank 3): 7.72,9.56 7.72,9.79 7.46,9.79 7.46,9.53 7.69,9.53
  pour Top (rank 3): 4.88,9.79 4.88,9.53 5.13,9.53 5.13,9.79
  pour Top (rank 3): 5.39,9.79 5.39,9.53 5.65,9.53 5.65,9.79
  pour Top (rank 3): 7.2,9.79 7.2,9.53 7.46,9.53 7.46,9.79
  pour Top (rank 3): 6.43,9.79 6.43,9.53 6.69,9.53 6.69,9.79
  pour Top (rank 3): 6.94,9.79 6.95,9.53 7.2,9.53 7.2,9.79
  pour Top (rank 3): 6.69,9.79 6.69,9.53 6.94,9.53 6.94,9.79
  pour Top (rank 3): 2.29,15.22 2.29,14.96 2.55,14.96 2.55,15.22
  pour Top (rank 3): 6.94,15.48 6.95,15.22 7.2,15.22 7.2,15.48
  pour Top (rank 3): 7.72,15.22 7.72,15.45 7.69,15.48 7.46,15.48 7.46,15.22
  pour Top (rank 3): 7.2,15.48 7.2,15.22 7.46,15.22 7.46,15.48
  pour Top (rank 3): 7.46,15.22 7.46,14.96 7.72,14.96 7.72,15.22
  pour Top (rank 3): 7.46,14.7 7.46,14.44 7.72,14.44 7.72,14.7
  pour Top (rank 3): 7.46,14.96 7.46,14.7 7.72,14.7 7.72,14.96
  pour Top (rank 3): 5.65,15.48 5.65,15.22 5.91,15.22 5.91,15.48
  pour Top (rank 3): 5.91,15.48 5.91,15.22 6.17,15.22 6.17,15.48
  pour Top (rank 3): 6.17,15.48 6.17,15.22 6.43,15.22 6.43,15.48
  pour Top (rank 3): 6.69,15.48 6.69,15.22 6.94,15.22 6.94,15.48
  pour Top (rank 3): 6.43,15.48 6.43,15.22 6.69,15.22 6.69,15.48
  pour Top (rank 3): 7.46,12.38 7.46,12.12 7.72,12.12 7.72,12.38
  pour Top (rank 3): 7.46,12.64 7.46,12.38 7.72,12.38 7.72,12.64
  pour Top (rank 3): 7.46,12.89 7.46,12.64 7.72,12.64 7.72,12.89
  pour Top (rank 3): 7.46,14.45 7.46,14.19 7.72,14.19 7.72,14.44
  pour Top (rank 3): 7.46,12.12 7.46,11.86 7.72,11.86 7.72,12.12
  pour Top (rank 3): 7.46,13.15 7.46,12.89 7.72,12.89 7.72,13.15
  pour Top (rank 3): 5.39,15.48 5.39,15.22 5.65,15.22 5.65,15.48
  pour Top (rank 3): 7.46,14.19 7.46,13.93 7.72,13.93 7.72,14.19
  pour Top (rank 3): 7.46,13.41 7.46,13.15 7.72,13.15 7.72,13.41
  pour Top (rank 3): 7.46,13.93 7.46,13.67 7.72,13.67 7.72,13.93
  pour Top (rank 3): 7.46,13.67 7.46,13.41 7.72,13.41 7.72,13.67
  pour Top (rank 3): 4.62,15.48 4.62,15.22 4.88,15.22 4.88,15.48
  pour Top (rank 3): 2.55,15.48 2.32,15.48 2.29,15.45 2.29,15.22 2.55,15.22
  pour Top (rank 3): 2.29,14.19 2.29,13.93 2.55,13.93 2.55,14.19
  pour Top (rank 3): 2.29,14.45 2.29,14.19 2.55,14.19 2.55,14.44
  pour Top (rank 3): 7.72,12.89 7.72,12.64 7.98,12.64 7.98,12.89
  pour Top (rank 3): 2.29,14.96 2.29,14.7 2.55,14.7 2.55,14.96
  pour Top (rank 3): 2.29,14.7 2.29,14.44 2.55,14.44 2.55,14.7